# EAGLE design Alarmzentrale zum Fensterkontakt (EAGLE 7.5.0)
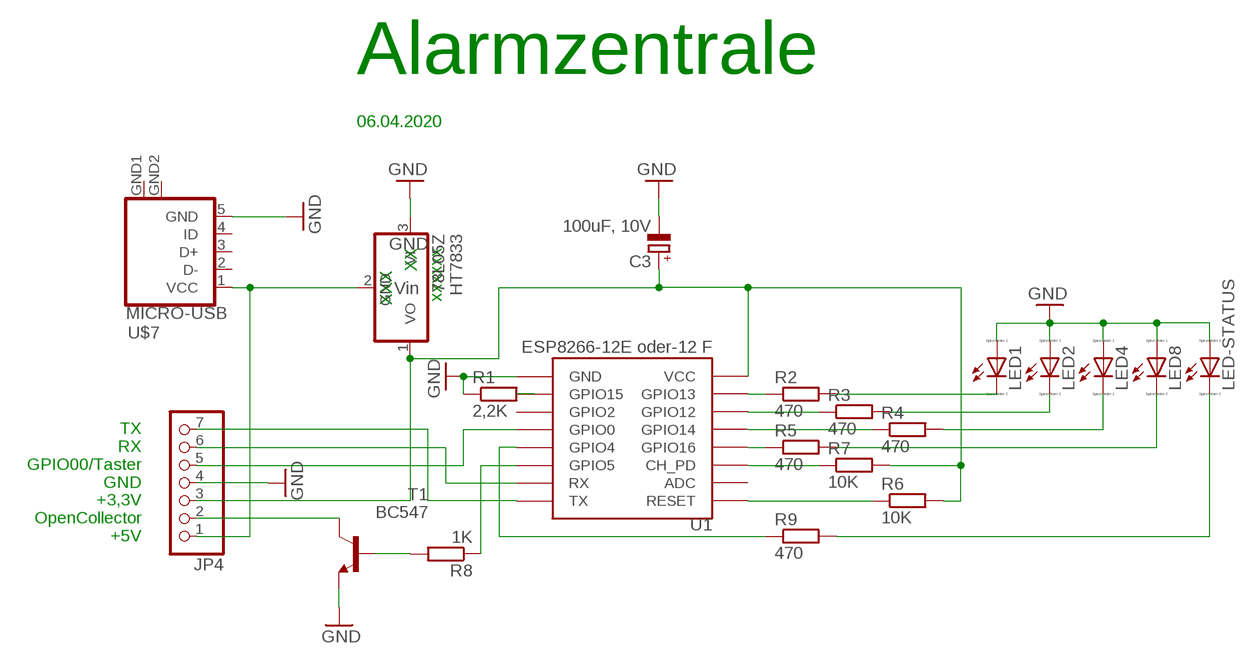
[diagram p0: schematic, sheet 1]

## Parts
C3  100uF, 10V  CPOL-EUE5-4  [E5-4]
HT7833  78L05Z  [TO92]
JP4  PINHD-1X7  [1X07]
LED1  LED_ELD260  [LED_LD260]
LED2  LED_ELD260  [LED_LD260]
LED4  LED_ELD260  [LED_LD260]
LED8  LED_ELD260  [LED_LD260]
LED-STATUS  LED_ELD260  [LED_LD260]
R1  2,2K  R-EU_0207/7  [0207/7]
R2  470  R-EU_0207/7  [0207/7]
R3  470  R-EU_0207/7  [0207/7]
R4  470  R-EU_0207/7  [0207/7]
R5  470  R-EU_0207/7  [0207/7]
R6  10K  R-EU_0207/7  [0207/7]
R7  10K  R-EU_0207/7  [0207/7]
R8  1K  R-EU_0207/7  [0207/7]
R9  470  R-EU_0207/7  [0207/7]
T1  BC547  -NPN-TO92L  [TO92L]
U1  ESP8266-12E oder-12 F  ESP12  [ESP12]
U$7  MICRO-USB  [MICRO-USB]

## Nets
GND: C3.- HT7833.3(VI) JP4.4 LED1.A LED2.A LED4.A LED8.A LED-STATUS.A R1.1 T1.1(E) U1.GND U$7.5(GND)
N$1: C3.+ HT7833.1(VO) JP4.3 R6.2 R7.2 U1.VCC
N$2: R2.1 U1.GPIO13
N$3: R3.1 U1.GPIO12
N$4: JP4.7 U1.TX
N$5: R4.1 U1.GPIO14
N$6: R5.1 U1.GPIO16
N$7: R7.1 U1.CH_PD
N$8: R6.1 U1.RESET
N$9: R8.2 T1.2(B)
N$10: JP4.6 U1.RX
N$11: LED1.K(C) R2.2
N$12: R1.2 U1.GPIO15
N$13: LED2.K(C) R3.2
N$14: LED4.K(C) R4.2
N$15: LED8.K(C) R5.2
N$16: R9.1 U1.GPIO4
N$18: HT7833.2(GND) JP4.1 U$7.1(VCC)
N$19: JP4.2 T1.3(C)
N$20: LED-STATUS.K(C) R9.2
N$24: R8.1 U1.GPIO5
N$25: JP4.5 U1.GPIO0
Unconnected: U1.ADC U1.GPIO2 U$7.2(D-) U$7.3(D+) U$7.4(ID)

## Notes on the sheet
- Alarmzentrale
- 06.04.2020
- GND | XX
- Vin
- XXX | xxxxxx
- TX
  RX
  GPIO00/Taster
  GND
  +3,3V
  OpenCollector
  +5V

## Power pins joined to a net without a drawn wire
GND: U$7.GND1(GND) U$7.GND2(GND)

## Library data of the parts
C3 = rcl:CPOL-EU: POLARIZED CAPACITOR, European symbol
HT7833 = linear:78*: Positive VOLTAGE REGULATOR Source: http://cache.national.com/ds/LM/LM78L05.pdf http://www.fairchildsemi.com/ds/LM/LM7805.pdf
JP4 = pinhead:PINHD-1X7: PIN HEADER
LED1 LED2 LED4 LED8 LED-STATUS = eagle-ltspice:LED_E: LED Source: http://www.osram.convergy.de Source: www.luxeon.com Source: www.kingbright.com; SPICEMODEL: NONE; SPICEPREFIX: D; SPICETYPE: diode
R1-R9 = rcl:R-EU_: RESISTOR, European symbol
T1 = transistor:*-NPN-: NPN Transistror BF959 corrected 2008.03.06
U1 = esp8266modules:ESP12: ESP8266 Wifi module 12
U$7 = microusb:MICRO-USB: Micro USB B connector

## Board
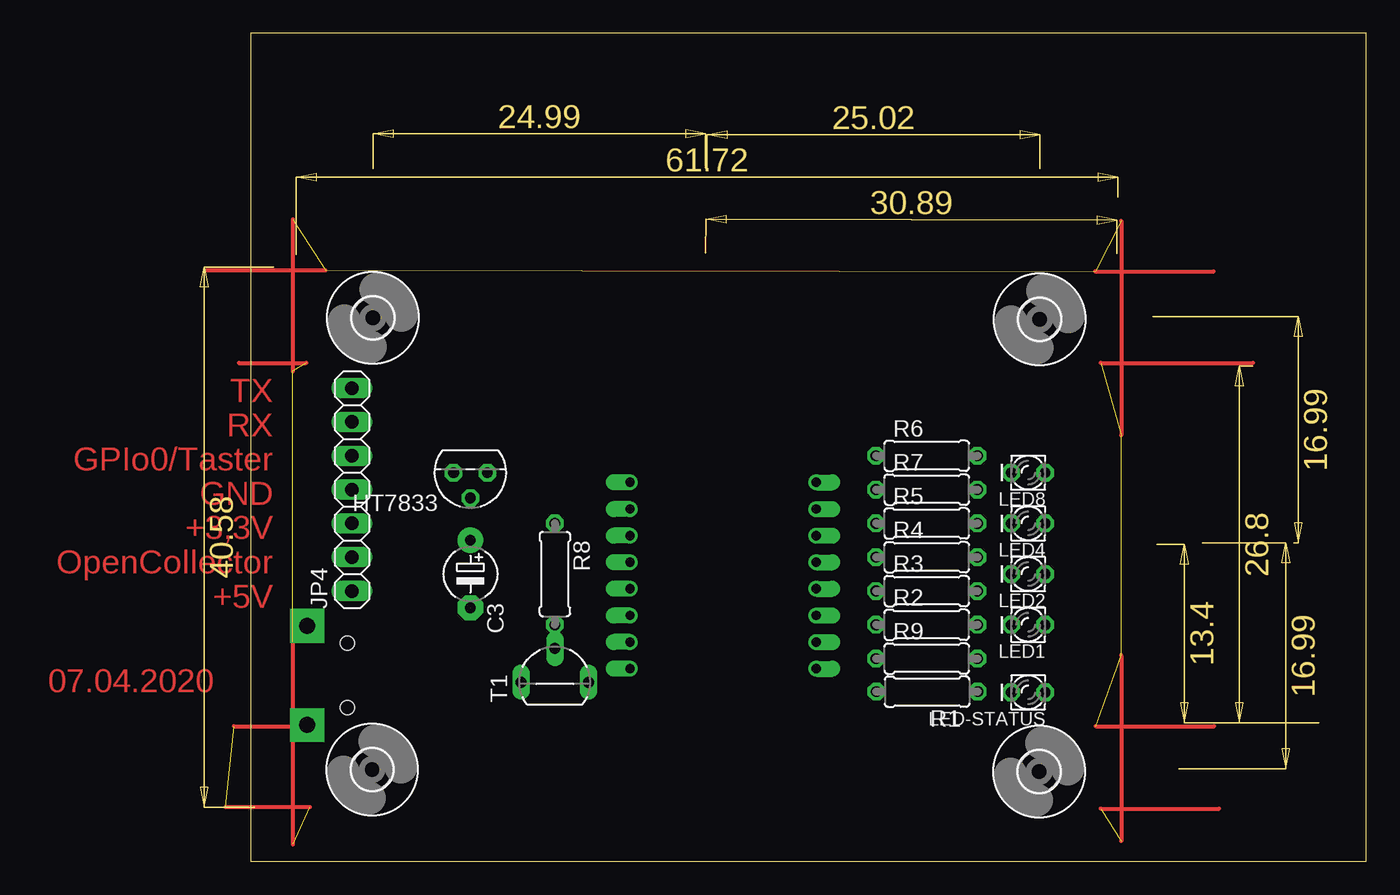
[diagram p1: board, top side]
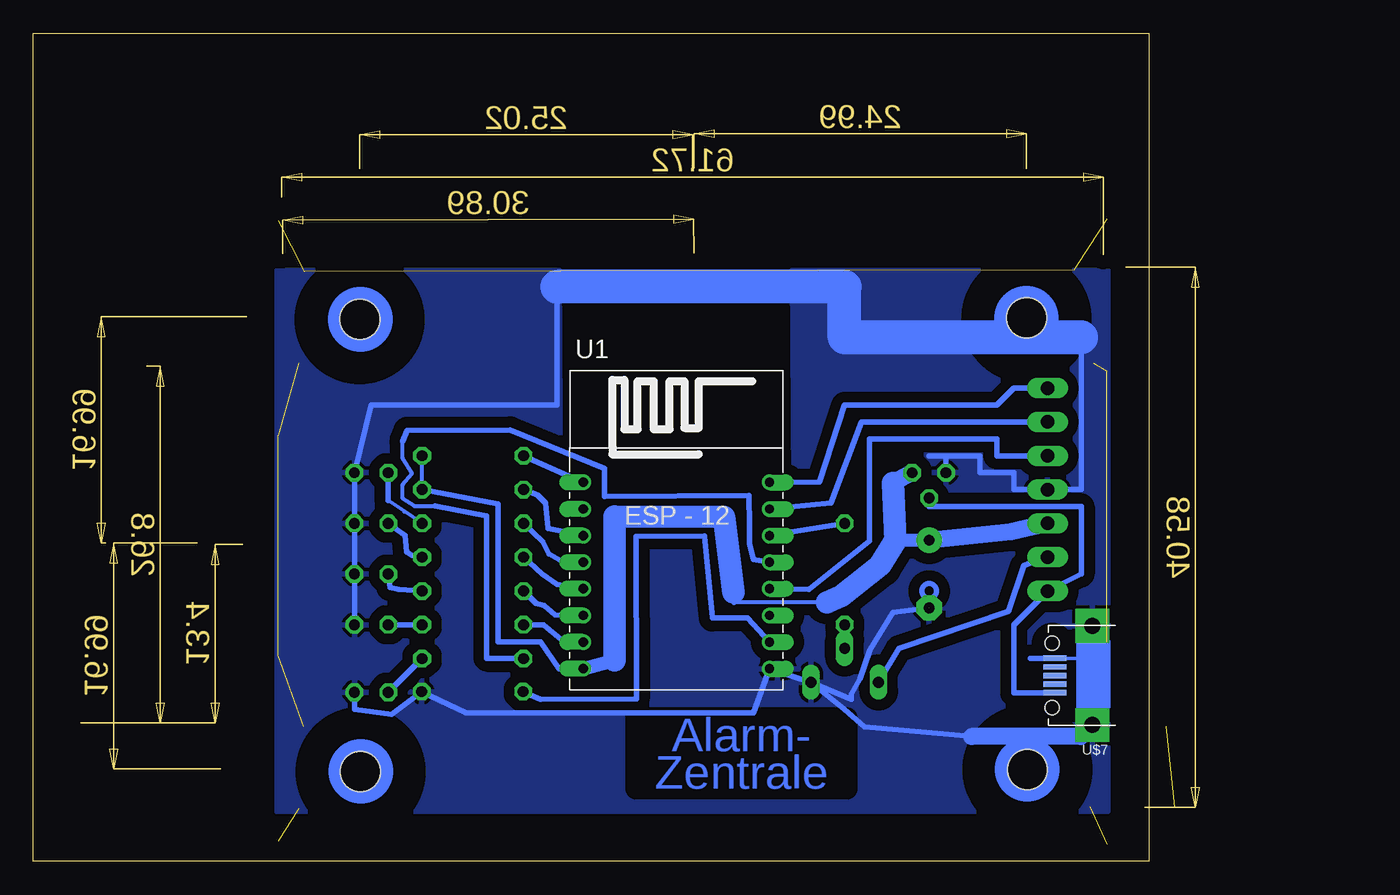
[diagram p2: board, bottom side, seen from below]

Size 83.82 x 62.23 mm. Coordinates in mm from the lower left corner, seen from the top.
Outline: 0,0 83.82,0 83.82,62.23 0,62.23 0,0
Copper layers (1*16): Top 0.035mm / dielectric 1.5mm / Bottom 0.035mm
Design rules "default": minimum track width 10mil, minimum drill 24mil, track to track 8mil, track to pad 8mil, pad to pad 8mil, via to via 8mil, smd to smd 8mil, copper to edge 40mil, drill to drill 8mil, minimum pad ring 10mil, minimum via ring 8mil, stop-mask expansion 4mil, vias tented up to drill 0mil, thermal gap 10mil

### Footprints (pad centres in the part's own frame; a part is rotated, then mirrored left to right if it is on the bottom)
E5-4 = drill 0.813 pad 1.905: + -2.54,0 | drill 0.813 pad 1.905 octagon: - 2.54,0
TO92 = drill 0.813 octagon: 1 -1.27,0; 2 0,1.905; 3 1.27,0
1X07 = drill 1.016 long: 1 -7.62,0; 2 -5.08,0; 3 -2.54,0; 4 0,0; 5 2.54,0; 6 5.08,0; 7 7.62,0
LED_LD260 = drill 0.813 octagon: A -1.27,0; K 1.27,0
0207/7 = drill 0.813 octagon: 1 -3.81,0; 2 3.81,0
TO92L = drill 0.813 long: 1 0,-2.54; 2 2.54,0; 3 0,2.54
ESP12 = drill 0.7 offset: ADC -7.1,3.8; CH_PD -7.1,1.8; GND 6.9,-8.2; GPIO0 6.9,-2.2; GPIO2 6.9,-4.2; GPIO4 6.9,-0.2; GPIO5 6.9,1.8; GPIO12 -7.1,-4.2; GPIO13 -7.1,-6.2; GPIO14 -7.1,-2.2; GPIO15 6.9,-6.2; GPIO16 -7.1,-0.2; RESET -7.1,5.8; RX 6.9,3.8; TX 6.9,5.8; VCC -7.1,-8.2
3,0 = hole 3: 0,0
MICRO-USB = smd 0.4 x 1.75: 1 -1.3,4.525; 2 -0.65,4.525; 3 0,4.525; 4 0.65,4.525; 5 1.3,4.525 | drill 1.2 pad 2.54 square: GND1 -3.725,1.7; GND2 3.725,1.7 | hole 1.05: -2.425,4.73; 2.425,4.73

### Placement (x,y rotation side)
C3  16.51,21.59 270 top
HT7833  16.51,29.21 180 top
JP4  7.62,27.94 90 top
LED1  58.42,17.78 180 top
LED2  58.42,21.59 180 top
LED4  58.42,25.4 180 top
LED8  58.42,29.21 180 top
LED-STATUS  58.42,12.7 180 top
R1  50.83,12.75 180 top
R2  50.8,17.78 0 top
R3  50.8,20.32 0 top
R4  50.8,22.86 0 top
R5  50.8,25.4 0 top
R6  50.8,30.48 0 top
R7  50.8,27.94 0 top
R8  22.86,21.59 270 top
R9  50.8,15.24 0 top
T1  22.86,13.46 90 top
U1  35.41,22.68 0 bottom
U$2  [3,0]  9.13,6.9 0 top
U$3  [3,0]  59.24,6.74 0 top
U$4  [3,0]  59.29,40.74 0 top
U$5  [3,0]  9.19,40.84 0 top
U$7  2.54,13.97 90 bottom

### Tracks (layer width: path | path; a pad name or v marks a point on that pad's centre or on a via)
GND  (1 unrouted)
  Bottom 0.305: U$7.5 3.75,15.32 | 5.08,12.19 5.08,11.68
  Bottom 0.406: LED-STATUS.A 59.69,11.43 56.9,11.05 R1.1 51.31,11.18 29.72,11.18 U1.GND T1.1 | 5.08,39.37 5.08,27.94 JP4.4 10.16,27.94 10.16,29.21 12.7,29.21 12.7,30.48 15.24,30.48 | 44.45,43.18 44.45,34.29 58.42,34.29 LED8.A LED4.A LED2.A LED1.A | T1.1 22.35,12.19 22.35,12.57 21.72,13.72 20.95,15.88 19.23,18.7 C3.- | 3.75,15.32 4.14,12.46 | 4.14,12.46 5.08,12.19 | 5.08,11.68 5.14,9.39 | 13.33,9.39 21.38,10.12 22.86,11.43 T1.1 | U$7.GND1 4.14,12.46 | 15.24,30.48 16.51,30.48 | HT7833.3 15.24,30.48
  Bottom 1.27: 5.14,9.39 13.33,9.39
  Bottom 2.54: 5.08,39.37 22.86,39.37 22.86,43.18 44.45,43.18
  pour Bottom (isolate 0.813): 3.09,44.4 26.8,44.45 26.67,28.19 44.2,28.19 44.32,44.45 65.48,44.38 65.48,3.74 3.09,3.76
N$1
  Bottom 0.305: R7.2 R6.2 | 24.2,19.47 31.16,19.47
  Bottom 0.406: 19.26,24.16 19.24,28.43 | R7.2 48.89,26.87 48.89,16.49 45.72,16.51 44.32,14.48 U1.VCC | 31.16,19.47 31.22,20.21
  Bottom 1.016: U1.VCC 40.13,15.11 | C3.+ 19.26,24.16
  Bottom 1.27: HT7833.1 19.24,28.43 | JP4.3 10.36,24.76 C3.+
  Bottom 1.676: 40.13,15.11 40.13,25.91 31.92,25.89 31.22,20.21 | 19.24,28.43 19.05,24.13 20.19,22.23 23.11,19.94 24.2,19.47
N$2
  Bottom 0.406: R2.1 45.47,17.78 43.94,16.51 U1.GPIO13
N$3
  Bottom 0.406: U1.GPIO12 44.6,18.51 45.42,19.24 46.06,19.39 R3.1
N$4
  Bottom 0.406: U1.TX 24.77,28.51 22.86,34.29 11.43,34.29 10.16,35.56 JP4.7
N$5
  Bottom 0.406: U1.GPIO14 44.45,20.83 45.59,21.59 R4.1
N$6
  Bottom 0.406: U1.GPIO16 44.2,22.61 45.09,23.11 45.56,24.06 R5.1
N$7
  Bottom 0.406: U1.CH_PD 45.16,25.02 45.33,26.93 45.95,27.52 R7.1
N$8
  Bottom 0.406: U1.RESET R6.1
N$9
  Bottom 0.406: T1.2 R8.2
N$10
  Bottom 0.406: U1.RX 23.88,26.92 21.59,33.02 JP4.6
N$11
  Bottom 0.406: R2.2 LED1.K
N$12
  Bottom 0.406: U1.GPIO15 30.16,18.29 32.8,18.29 33.37,24.47 38.55,24.43 38.51,12.22 45.72,12.19 R1.2
N$13
  Bottom 0.406: R3.2 56.39,20.45 57.02,20.57 LED2.K
N$14
  Bottom 0.406: R4.2 55.37,22.99 55.75,23.24 55.88,24.51 LED4.K
N$15
  Bottom 0.305: R5.2 55.93,26.29 57.17,27.14
  Bottom 0.406: 57.17,27.14 57.15,28.45 LED8.K
N$16
  Bottom 0.305: 53.62,26.7 55.18,26.7 56.07,27.28 56.07,28.31 55.38,29.15 56.05,30.28 56.05,31.55
  Bottom 0.406: R9.1 49.75,15.27 49.75,25.97 53.62,26.7 | U1.GPIO4 29.72,22.7 30.02,23.85 30.02,25.23 30.06,27.5 40.91,27.44 40.91,29.54 47.99,32.42 55.74,32.38 56.05,31.55
N$17
  Bottom 0.406: 7.64,15.26 8.91,15.26
N$18
  Bottom 0.406: 6.86,20.83 7.66,20.42 JP4.1 | JP4.1 5.08,21.59 5.08,26.67 16.51,26.67 HT7833.2 | JP4.1 7.64,20.3 10.16,17.78 10.16,12.65 7.98,12.66 U$7.1
N$19
  Bottom 0.406: JP4.2 9.4,22.23 10.54,18.8 18.8,16 T1.3
N$20
  Bottom 0.406: R9.2 LED-STATUS.K
N$23  (11 unrouted)
  Top 0.305: -1.27,10.16 5.08,10.16 | 3.17,16.51 3.17,1.27 | -0.89,37.47 4.19,37.47 | 63.88,37.47 75.31,37.47 | 63.5,10.16 72.39,10.16 | 65.41,15.49 65.41,1.52 | 65.41,48.13 65.41,32 | 3.17,48.26 3.17,36.83 | -3.27,44.42 5.62,44.42 | 63.47,44.32 72.36,44.32 | 63.88,3.97 72.77,3.97 | -1.91,4.1 4.45,4.1
N$24
  Bottom 0.406: R8.1 U1.GPIO5
N$25
  Bottom 0.406: U1.GPIO0 25.53,20.45 21,24.07 21.01,31.75 11.43,31.75 11.43,30.48 JP4.5
(copper drawn outside any net)
  shapes: Bottom area x1, Bottom circle x7

### Text on the board
Top: TX / RX / GPIo0/Taster / GND / +3,3V / OpenCollector / +5V | 07.04.2020
Bottom: Alarm- / Zentrale